# Altium schematic sheet main.SchDoc
size A3; Hw_rev: R1; Address3: Firenze; Address4: ITALY; Revision: 0; SheetNumber: 2; SheetTotal: 4
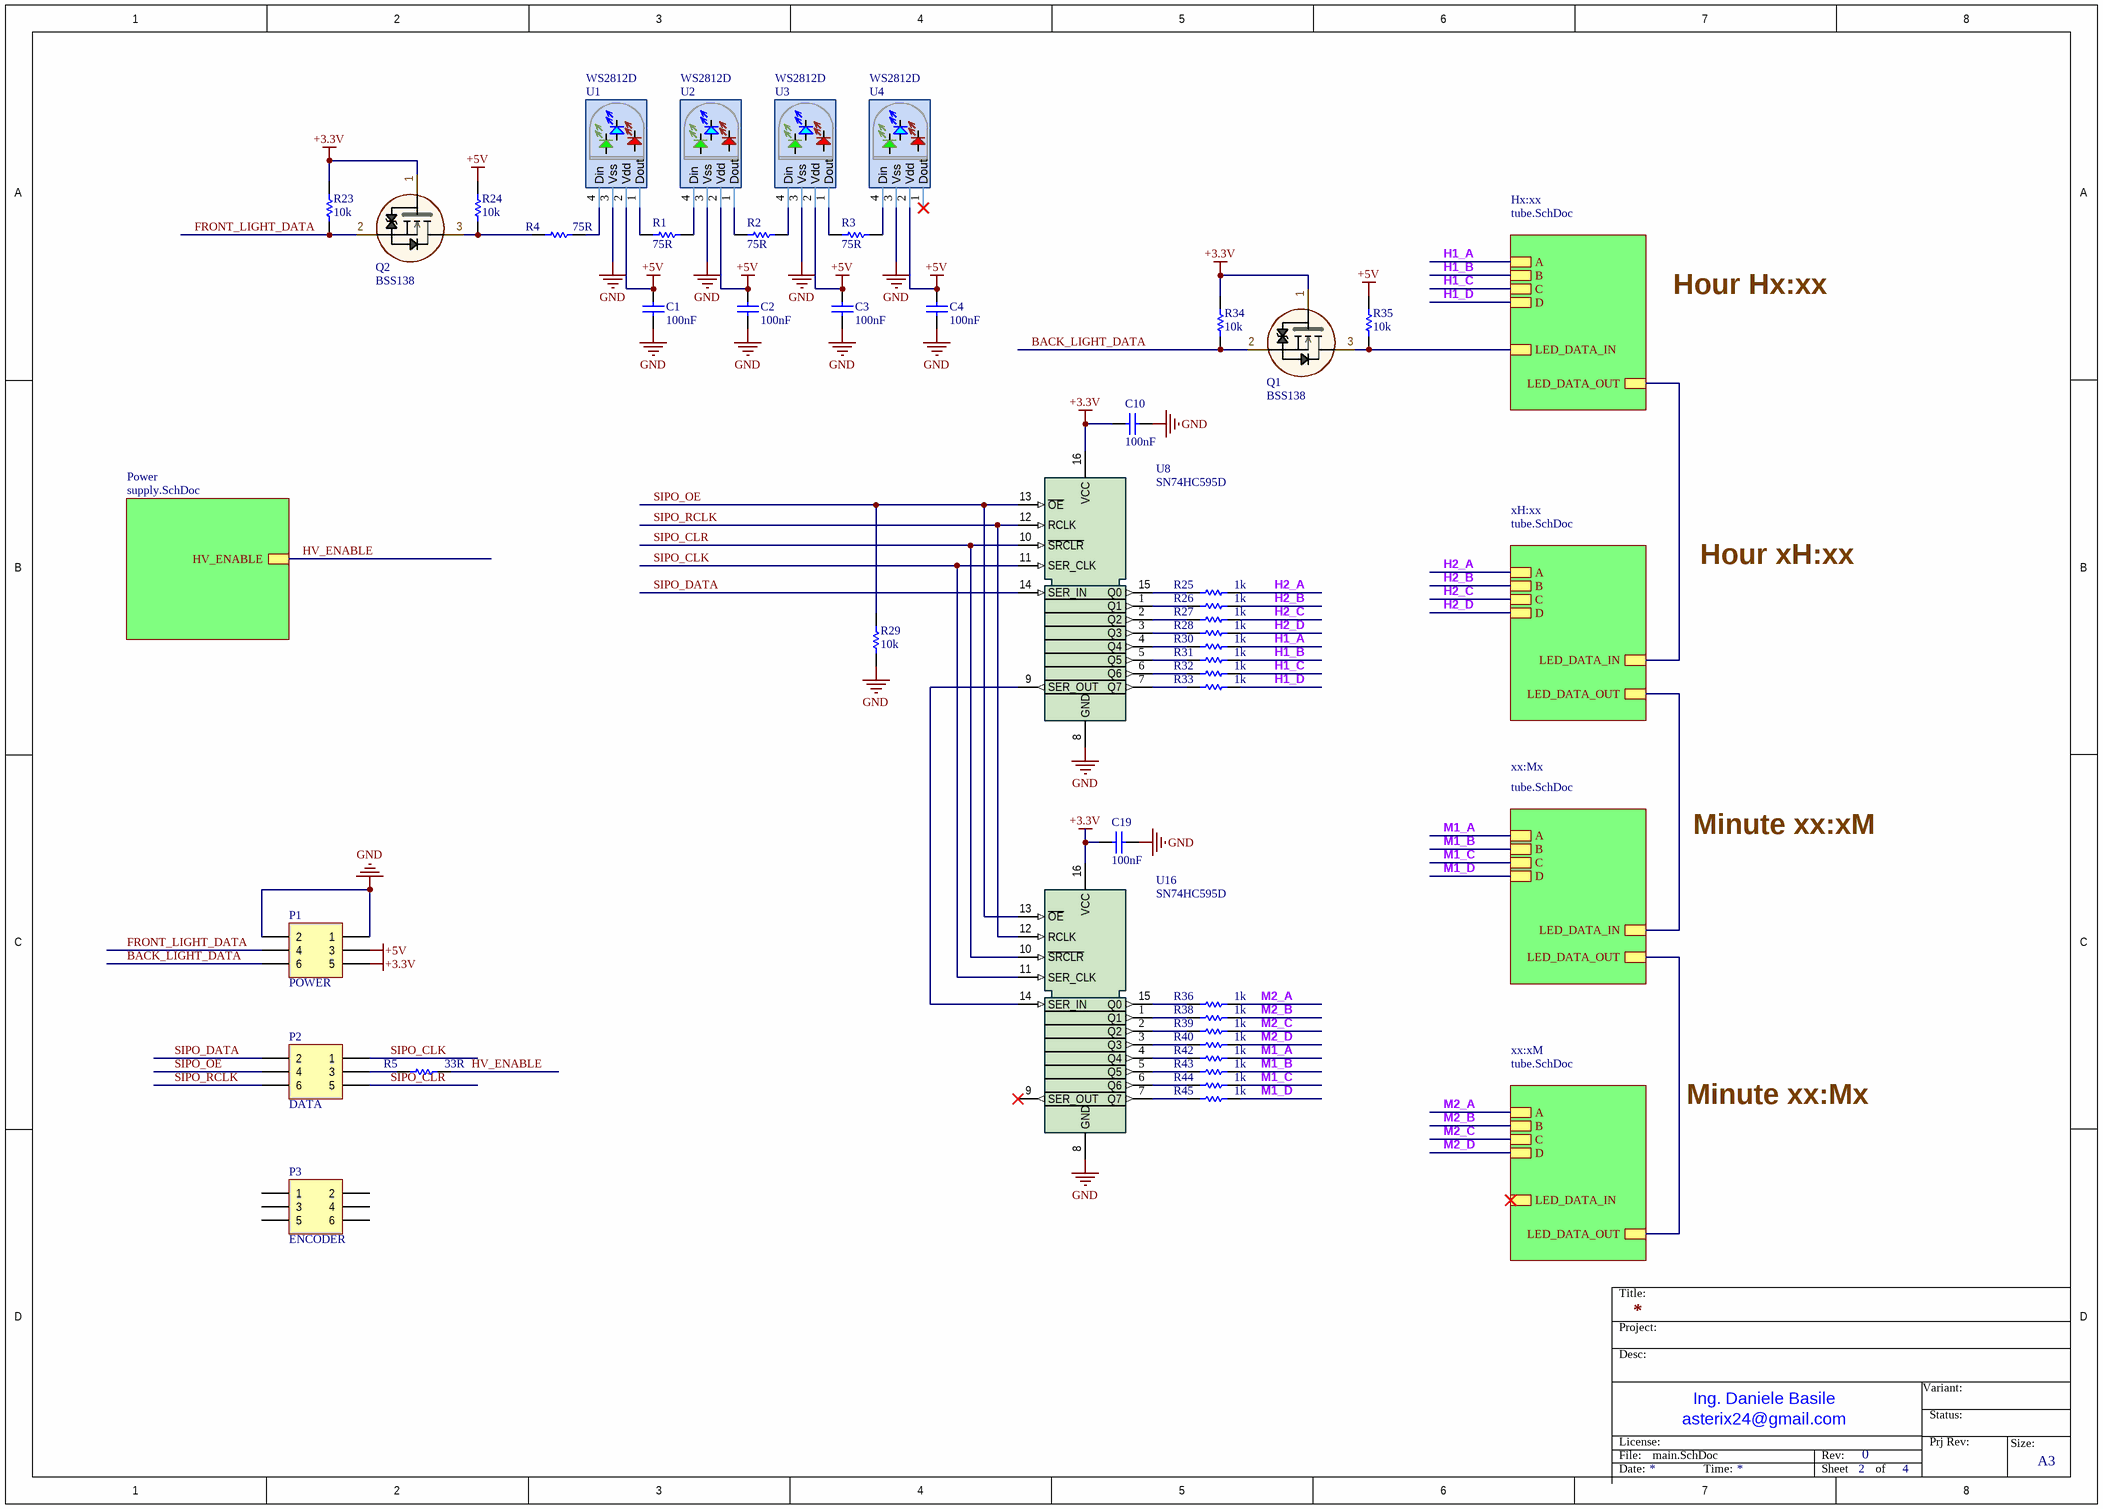
[diagram p0: main.SchDoc]

## Parts
C1  100nF  [0603_[1608]]
C2  100nF  [0603_[1608]]
C3  100nF  [0603_[1608]]
C4  100nF  [0603_[1608]]
C10  100nF  [0603_[1608]]
C19  100nF  [0603_[1608]]
P1  POWER  [HEADER_2X3_2.54MM_THD]
P2  DATA  [HEADER_2X3_2.54MM_THD]
P3  ENCODER  [HEADER_2X3_2.54MM_THD]
Q1  BSS138  [SOT-23]
Q2  BSS138  [SOT-23]
R1  75R  [0603_[1608]]
R2  75R  [0603_[1608]]
R3  75R  [0603_[1608]]
R4  75R  [0603_[1608]]
R5  33R  [0603_[1608]]
R23  10k  [0603_[1608]]
R24  10k  [0603_[1608]]
R25  1k  [0603_[1608]]
R26  1k  [0603_[1608]]
R27  1k  [0603_[1608]]
R28  1k  [0603_[1608]]
R29  10k  [0603_[1608]]
R30  1k  [0603_[1608]]
R31  1k  [0603_[1608]]
R32  1k  [0603_[1608]]
R33  1k  [0603_[1608]]
R34  10k  [0603_[1608]]
R35  10k  [0603_[1608]]
R36  1k  [0603_[1608]]
R38  1k  [0603_[1608]]
R39  1k  [0603_[1608]]
R40  1k  [0603_[1608]]
R42  1k  [0603_[1608]]
R43  1k  [0603_[1608]]
R44  1k  [0603_[1608]]
R45  1k  [0603_[1608]]
U1  WS2812D  [R5_RGB_LED_THD]
U2  WS2812D  [R5_RGB_LED_THD]
U3  WS2812D  [R5_RGB_LED_THD]
U4  WS2812D  [R5_RGB_LED_THD]
U8  SN74HC595D  [soic16]
U16  SN74HC595D  [soic16]

## Sub-sheets
Hx:xx = tube.SchDoc: LED_DATA_IN, LED_DATA_OUT, A, B, C, D
Power = supply.SchDoc: HV_ENABLE
xH:xx = tube.SchDoc: LED_DATA_IN, LED_DATA_OUT, A, B, C, D
xx:Mx = tube.SchDoc: LED_DATA_IN, LED_DATA_OUT, A, B, C, D
xx:xM = tube.SchDoc: LED_DATA_IN, LED_DATA_OUT, A, B, C, D

## Nets
+3.3V: C10.2 C19.2 P1.5 Q1.1(G) Q2.1(G) R23.1 R34.1 U8.16(VCC) U16.16(VCC)
+5V: C1.1 C2.1 C3.1 C4.1 P1.3 R24.1 R35.1 U1.2(Vdd) U2.2(Vdd) U3.2(Vdd) U4.2(Vdd)
GND: C1.2 C2.2 C3.2 C4.2 C10.1 C19.1 P1.1 P1.2 R29.2 U1.3(Vss) U2.3(Vss) U3.3(Vss) U4.3(Vss) U8.8(GND) U16.8(GND)
BACK_LIGHT_DATA: P1.6 Q1.2(S) R34.2
FRONT_LIGHT_DATA: P1.4 Q2.2(S) R23.2
H1_A: R30.1 ; sheet Hx:xx/A
H1_B: R31.1 ; sheet Hx:xx/B
H1_C: R32.1 ; sheet Hx:xx/C
H1_D: R33.1 ; sheet Hx:xx/D
H2_A: R25.1 ; sheet xH:xx/A
H2_B: R26.1 ; sheet xH:xx/B
H2_C: R27.1 ; sheet xH:xx/C
H2_D: R28.1 ; sheet xH:xx/D
HV_ENABLE: R5.1 ; sheet Power/HV_ENABLE
M1_A: R42.1 ; sheet xx:Mx/A
M1_B: R43.1 ; sheet xx:Mx/B
M1_C: R44.1 ; sheet xx:Mx/C
M1_D: R45.1 ; sheet xx:Mx/D
M2_A: R36.1 ; sheet xx:xM/A
M2_B: R38.1 ; sheet xx:xM/B
M2_C: R39.1 ; sheet xx:xM/C
M2_D: R40.1 ; sheet xx:xM/D
SIPO_CLK: P2.1 U8.11(SER_CLK) U16.11(SER_CLK)
SIPO_CLR: P2.5 U8.10(~{SRCLR}) U16.10(~{SRCLR})
SIPO_DATA: P2.2 U8.14(SER_IN)
SIPO_OE: P2.4 R29.1 U8.13(~{OE}) U16.13(~{OE})
SIPO_RCLK: P2.6 U8.12(RCLK) U16.12(RCLK)
NetP2_3: P2.3 R5.2
NetQ1_3: Q1.3(D) R35.2 ; sheet Hx:xx/LED_DATA_IN
NetQ2_3: Q2.3(D) R4.2 R24.2
NetR1_1: R1.1 U1.1(Dout)
NetR1_2: R1.2 U2.4(Din)
NetR2_1: R2.1 U2.1(Dout)
NetR2_2: R2.2 U3.4(Din)
NetR3_1: R3.1 U3.1(Dout)
NetR3_2: R3.2 U4.4(Din)
NetR4_1: R4.1 U1.4(Din)
NetR25_2: R25.2 U8.15(Q0)
NetR26_2: R26.2 U8.1(Q1)
NetR27_2: R27.2 U8.2(Q2)
NetR28_2: R28.2 U8.3(Q3)
NetR30_2: R30.2 U8.4(Q4)
NetR31_2: R31.2 U8.5(Q5)
NetR32_2: R32.2 U8.6(Q6)
NetR33_2: R33.2 U8.7(Q7)
NetR36_2: R36.2 U16.15(Q0)
NetR38_2: R38.2 U16.1(Q1)
NetR39_2: R39.2 U16.2(Q2)
NetR40_2: R40.2 U16.3(Q3)
NetR42_2: R42.2 U16.4(Q4)
NetR43_2: R43.2 U16.5(Q5)
NetR44_2: R44.2 U16.6(Q6)
NetR45_2: R45.2 U16.7(Q7)
NetU8_9: U8.9(SER_OUT) U16.14(SER_IN)
(unnamed): sheet Hx:xx/LED_DATA_OUT, sheet xH:xx/LED_DATA_IN
(unnamed): sheet xH:xx/LED_DATA_OUT, sheet xx:Mx/LED_DATA_IN
(unnamed): sheet xx:Mx/LED_DATA_OUT, sheet xx:xM/LED_DATA_OUT

Not connected (* = marked no-connect by the designer): P3 1 2 3 4 5 6; U4 1(Dout)*; U16 9(SER_OUT)*

## Notes on the sheet
- Hour Hx:xx
- Hour xH:xx
- Minute xx:xM
- Minute xx:Mx
- Title:
- Project:
- Desc:
- Variant:
- File:
- License:
- asterix24@gmail.com
- Ing. Daniele Basile
- Rev:
- Prj Rev:
- Status:
- Size:
- Date:
- Time:
- Sheet
- of
- A3

## Library data of the parts
C1-C4 C10 C19 = Cap: Capacitor; Value: 100nF; NOTE Manufacturer PN: *; NOTE Manufacturer: *; MountTechnology: *; CODE Develer: *; ComponentLink1Description: New link; ComponentLink1URL: *; NOTE Description: *; NOTE Description 2: *
P1-P3 = Header 3X2: Header, 3-Pin, Dual row; LatestRevisionDate: 17-Jul-2002; LatestRevisionNote: Re-released for DXP Platform.; Publisher: Altium Limited
Q1 Q2 = BSS138: N-MOSFET 50V 0,22A; Publisher: Develer srl; Revision: 0.1; NOTE Manufacturer PN: *; NOTE Manufacturer: *; MountTechnology: SMT; CODE Develer: *; NOTE Description: *; NOTE Description 2: *
R1-R5 R23-R36 R38-R40 R42-R45 = Res: Resistor; Publisher: Develer srl; Revision: 0.1; NOTE Manufacturer PN: *; NOTE Manufacturer: *; MountTechnology: SMT; CODE Develer: *; NOTE Description: *; NOTE Description 2: *
U1-U4 = WS2812D: Adressable Led RGB 1wire, THD; Publisher: Develer srl; Revision: 0.1; NOTE Manufacturer PN: *; NOTE Manufacturer: *; MountTechnology: SMT; CODE Develer: *; NOTE Description: *; NOTE Description 2: *; CODE LCSC: C190565
U8 U16 = SN74HC595D: 8-Bit Shift Registers With 3-State Output Registers; Publisher: Develer srl; Revision: 0.1; NOTE Manufacturer PN: *; NOTE Manufacturer: *; MountTechnology: SMT; CODE Develer: *; NOTE Description: *; NOTE Description 2: *; Supplier 1: Digi-Key; Supplier 2: Newark; Supplier 3: Newark; Supplier 4: Avnet; Supplier Part Number 1: 497-2344-5-ND; Supplier Part Number 2: 26AC5117; Supplier Part Number 3: 89K1130; Supplier Part Number 4: ULN2003A